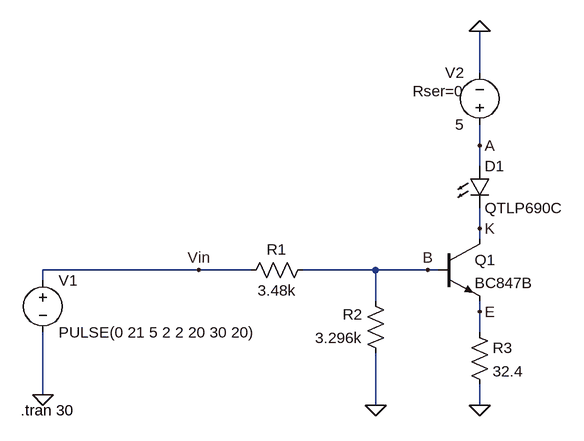
[diagram p0: schematic Schematic.asc]
Schematic.asc, the LTspice schematic file:
Version 4
SHEET 1 924 680
WIRE 560 -176 560 -240
WIRE 560 -64 560 -96
WIRE 560 -32 560 -64
WIRE 560 64 560 32
WIRE 560 80 560 64
WIRE 128 128 -112 128
WIRE 208 128 128 128
WIRE 400 128 288 128
WIRE 480 128 400 128
WIRE 496 128 480 128
WIRE -112 144 -112 128
WIRE 400 176 400 128
WIRE 560 192 560 176
WIRE 560 224 560 192
WIRE -112 320 -112 224
WIRE 400 336 400 256
WIRE 560 336 560 304
FLAG 400 336 0
FLAG 560 336 0
FLAG -112 320 0
FLAG 560 -240 0
FLAG 560 -64 A
FLAG 560 64 K
FLAG 560 192 E
FLAG 480 128 B
FLAG 128 128 Vin
SYMBOL voltage -112 128 R0
WINDOW 123 0 0 Left 2
WINDOW 39 0 0 Left 2
SYMATTR InstName V1
SYMATTR Value PULSE(0 21 5 2 2 20 30 20)
SYMBOL res 304 112 R90
WINDOW 0 0 56 VBottom 2
WINDOW 3 32 56 VTop 2
SYMATTR InstName R1
SYMATTR Value 3.48k
SYMBOL res 416 272 R180
WINDOW 0 36 76 Left 2
WINDOW 3 36 40 Left 2
SYMATTR InstName R2
SYMATTR Value 3.296k
SYMBOL npn 496 80 R0
SYMATTR InstName Q1
SYMATTR Value BC847B
SYMBOL voltage 560 -80 R180
WINDOW 0 24 96 Left 2
WINDOW 3 24 16 Left 2
WINDOW 123 0 0 Left 2
WINDOW 39 24 68 Left 2
SYMATTR InstName V2
SYMATTR Value 5
SYMATTR SpiceLine Rser=0
SYMBOL res 544 208 R0
SYMATTR InstName R3
SYMATTR Value 32.4
SYMBOL LED 544 -32 R0
SYMATTR InstName D1
SYMATTR Value QTLP690C
TEXT -146 344 Left 2 !.tran 30

The netlist it stands for:
* Schematic.asc
V1 Vin 0 PULSE(0 21 5 2 2 20 30 20)
R1 B Vin 3.48k
R2 0 B 3.296k
Q1 K B E 0 BC847B
V2 A 0 5 Rser=0
R3 E 0 32.4
D1 A K QTLP690C
.model D D
.lib standard.dio
.model NPN NPN
.model PNP PNP
.lib standard.bjt
.tran 30
.backanno
.end